# EAGLE design V5.9aSMD (EAGLE 7.6.0)
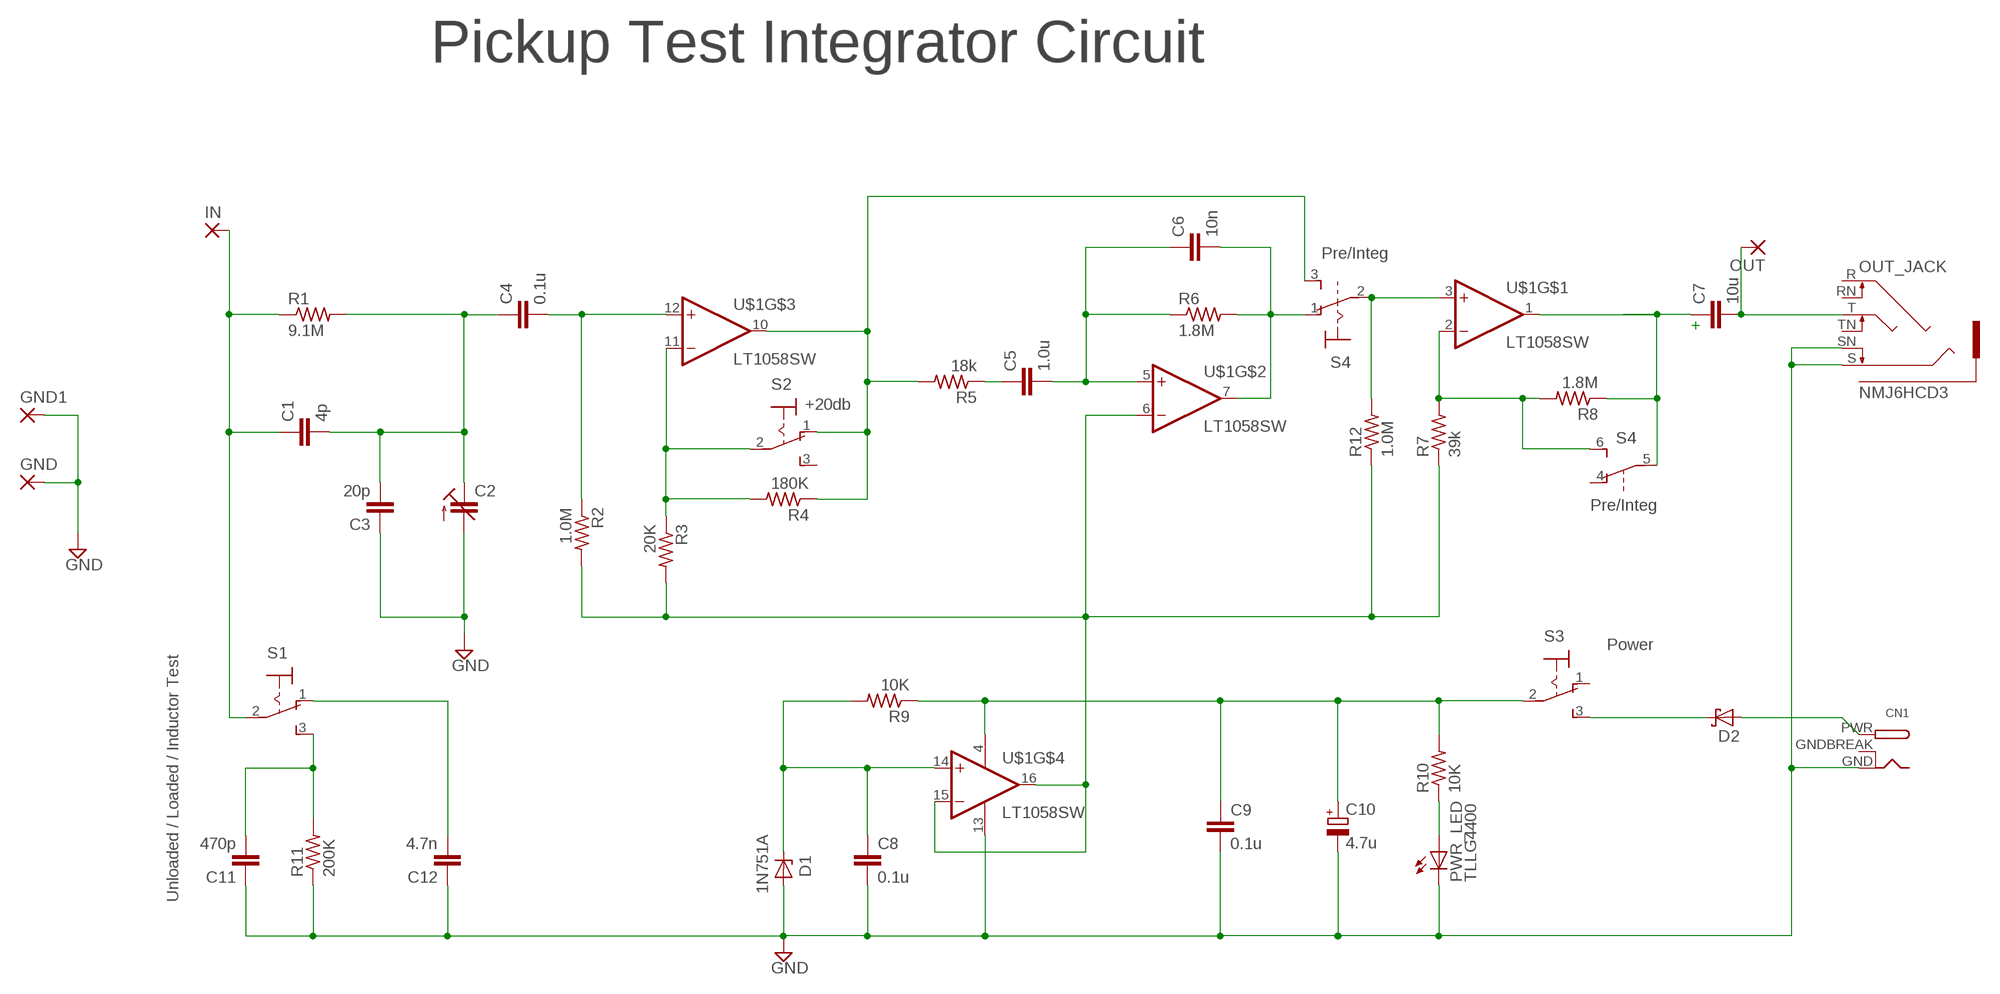
[diagram p0: schematic, sheet 1]

## Parts
C1  4p  C-EUC0805  [C0805]
C2  C-TRIMMGKG20015  [GKG20015]
C3  20p  C-EUC0805  [C0805]
C4  0.1u  C-EUC0805  [C0805]
C5  1.0u  C-EUC0805  [C0805]
C6  10n  C-EUC0805  [C0805]
C7  10u  C-EUC1206K  [C1206K]
C8  0.1u  C-EUC0805  [C0805]
C9  0.1u  C-EUC0805  [C0805]
C10  4.7u  CPOL-EUA/3216-18R  [A/3216-18R]
C11  470p  C-EUC0805  [C0805]
C12  4.7n  C-EUC0805  [C0805]
CN1  DCBARRELPTH  [DCJACK_2MM_PTH]
D1  ZENER-DIODESOD80C  [SOD80C]
D2  SCHOTTKY-DIODESMD  [SMB]
GND  2,54/1,1  [2,54/1,1]
GND1  2,54/1,1  [2,54/1,1]
IN  2,54/1,1  [2,54/1,1]
OUT  2,54/1,1  [2,54/1,1]
OUT_JACK  NMJ6HCD3  [AUDIO_JACK_NEUTRIK]
PWR_LED  TLLG4400  [LED3MM]
R1  9.1M  R-US_R0805  [R0805]
R2  1.0M  R-US_R0805  [R0805]
R3  20K  R-US_R0805  [R0805]
R4  180K  R-US_R0805  [R0805]
R5  18k  R-US_R0805  [R0805]
R6  1.8M  R-US_R0805  [R0805]
R7  39k  R-US_R0805  [R0805]
R8  1.8M  R-US_R0805  [R0805]
R9  10K  R-US_R0805  [R0805]
R10  10K  R-US_R0805  [R0805]
R11  200K  R-US_R0805  [R0805]
R12  1.0M  R-US_R0805  [R0805]
S1  320-916  [320-916]
S2  320-916  [320-916]
S3  320-916  [320-916]
S4  320-938  [320-938]
U$1  LT1058SW  [SO16W]

## Nets
GND: C2.1(A) C3.1 C8.2 C9.2 C10.- C11.1 C12.1 CN1.GND D1.A GND1.1(P) GND.1(P) OUT_JACK.S OUT_JACK.SN PWR_LED.K(C) R11.1 U$1.13(V-)
IT: C12.2 S1.1(O)
N$1: PWR_LED.A R10.1
N$2: C5.1 R5.1
N$3: D2.C S3.3(S)
N$4: R4.1 R5.2 S2.1(O) S4.3(1:S) U$1.10(OUT)
N$5: R3.1 R4.2 S2.2(P) U$1.11(-IN)
N$6: C6.2 R6.2 S4.1(1:O) U$1.7(OUT)
N$7: R7.2 R8.2 S4.6(B:S) U$1.2(-IN)
N$8: C7.1 R8.1 S4.5(B:P) U$1.1(OUT)
N$9: C1.2 C2.2(E) C3.2 C4.1 R1.2
N$10: C8.1 D1.C R9.2 U$1.14(+IN)
N$11: R12.2 S4.2(1:P) U$1.3(+IN)
N$12: C4.2 R2.1 U$1.12(+IN)
N$13: C1.1 IN.1(P) R1.1 S1.2(P)
N$14: R2.2 R3.2 R7.1 R12.1 U$1.6(-IN) U$1.15(-IN) U$1.16(OUT)
N$15: C9.1 C10.+ R9.1 R10.2 S3.2(P) U$1.4(V+)
N$16: C11.2 R11.2 S1.3(S)
N$18: C5.2 C6.1 R6.1 U$1.5(+IN)
N$21: CN1.PWR D2.A
N$22: C7.2 OUT.1(P) OUT_JACK.T
Unconnected: OUT_JACK.R OUT_JACK.RN OUT_JACK.TN S2.3(S) S3.1(O) S4.4(B:O)

## Notes on the sheet
- Pickup Test Integrator Circuit
- Pre/Integ
- +
- +20db
- Pre/Integ
- Power
- Unloaded / Loaded / Inductor Test

## Power pins joined to a net without a drawn wire
GNDBREAK: CN1.GNDBREAK

## Library data of the parts
C1 C3-C9 C11 C12 = rcl:C-EU: CAPACITOR, European symbol
C2 = rcl:C-TRIMM: Trimm capacitor
C10 = rcl:CPOL-EU: POLARIZED CAPACITOR, European symbol
CN1 = adafruit:DCBARREL: 2.0mm DC Barrel Jack DCJACK_2MM_PTH - Through Hole Jack (4UConnector: 05537)
D1 = diode:ZENER-DIODE: Z-Diode
D2 = diode:SCHOTTKY-DIODE: Schottky Diode
GND GND1 IN OUT = wirepad:2,54/1,1: THROUGH-HOLE PAD
OUT_JACK = Heliostat:NMJ6HCD3
PWR_LED = led:TLLG4400: Low Current (2mA) LED 3 mm Tinted Diffused Package color GREEN Source: Data sheet <http://www.farnell.com/datasheets/391098.pdf>; MF: VISHAY SEMICONDUCTOR; OC_FARNELL: 1612435
R1-R12 = rcl:R-US_: RESISTOR, American symbol
S1-S3 = switch:320-916: TOGGLE SWITCH distributor RS Components
S4 = switch:320-938: TOGGLE SWITCH distributor RS Components
U$1 = Heliostat:LT1058SW

## Board
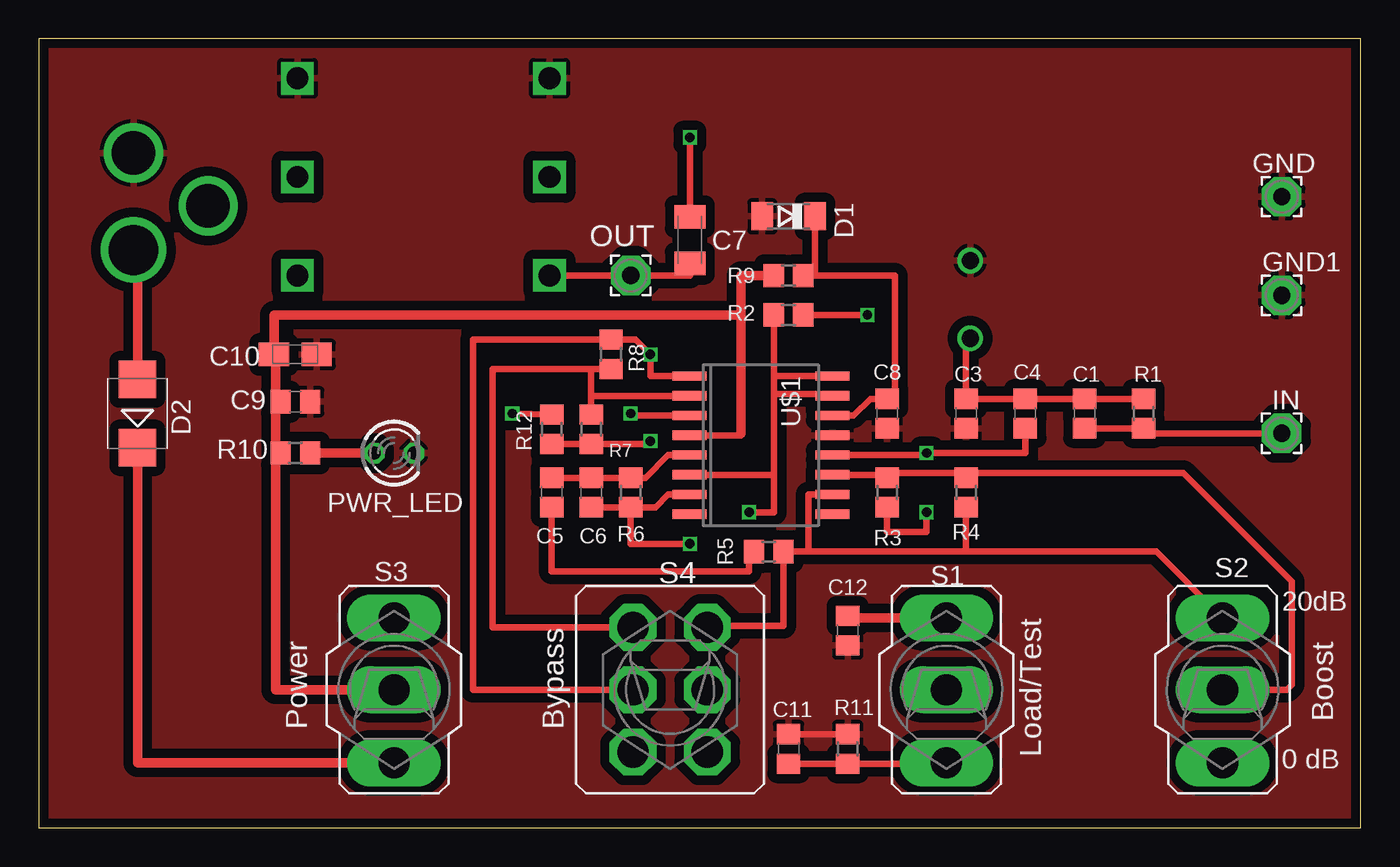
[diagram p1: board, top side]
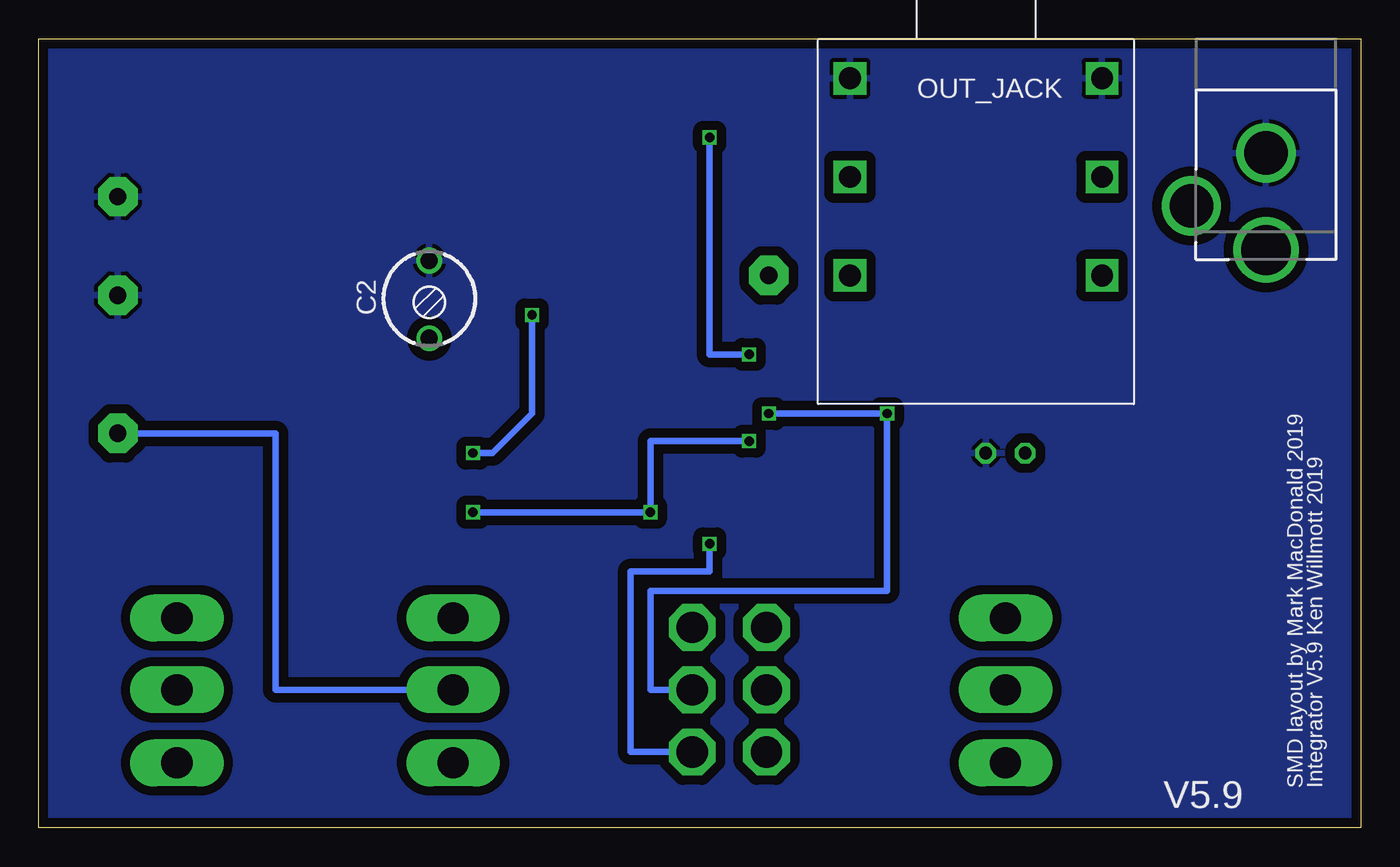
[diagram p2: board, bottom side, seen from below]

Size 85.09 x 50.8 mm. Coordinates in mm from the lower left corner, seen from the top.
Outline: 0,50.8 0,0 85.09,0 85.09,50.8 0,50.8
Copper layers (1*16): Top 0.035mm / dielectric 1.5mm / Bottom 0.035mm
Design rules "ITEADstudio_DRC": minimum track width 6mil, minimum drill 12mil, track to track 6mil, track to pad 6mil, pad to pad 6mil, via to via 6mil, smd to smd 0mil, copper to edge 10mil, drill to drill 10mil, minimum pad ring 10mil, minimum via ring 6mil, stop-mask expansion 2mil, vias tented up to drill 100mil, thermal gap 10mil

### Footprints (pad centres in the part's own frame; a part is rotated, then mirrored left to right if it is on the bottom)
C0805 = smd 1.3 x 1.5: 1 -0.95,0; 2 0.95,0
GKG20015 = drill 1.1: 1 -2.5,0; 2 2.5,0
C1206K = smd 1.5 x 2: 1 -1.5,0; 2 1.5,0
A/3216-18R = smd 1.95 x 1.5: + 1.375,0; - -1.375,0
DCJACK_2MM_PTH = drill 2.8: GND 0,7.35; GNDBREAK 4.8,10.75 | drill 3.2: PWR 0,13.6
SOD80C = smd 1.4 x 1.8: A 1.7,0; C -1.7,0
SMB = smd 2.4 x 2.4: A 2.2,0; C -2.2,0
2,54/1,1 = drill 1.118 pad 2.54 octagon: 1 0,0
AUDIO_JACK_NEUTRIK = drill 1.4 square: R -8.115,0; RN 8.115,0; S -8.115,6.35; SN 8.115,6.35; T -8.115,-6.35; TN 8.115,-6.35
LED3MM = drill 0.813 octagon: A -1.27,0; K 1.27,0
R0805 = smd 1.3 x 1.5: 1 -0.95,0; 2 0.95,0
320-916 = drill 2.007 long: 1 0,4.613; 2 0,0; 3 0,-4.713
320-938 = drill 2.007 octagon: 1 -2.388,4.013; 2 -2.388,0; 3 -2.388,-4.013; 4 2.388,4.013; 5 2.388,0; 6 2.388,-4.013
SO16W = smd 0.6 x 2.2: 1 -4.445,-4.6; 2 -3.175,-4.6; 3 -1.905,-4.6; 4 -0.635,-4.6; 5 0.635,-4.6; 6 1.905,-4.6; 7 3.175,-4.6; 8 4.445,-4.6; 9 4.445,4.6; 10 3.175,4.6; 11 1.905,4.6; 12 0.635,4.6; 13 -0.635,4.6; 14 -1.905,4.6; 15 -3.175,4.6; 16 -4.445,4.6

### Placement (x,y rotation side)
C1  67.31,26.67 90 top
C2  59.96,34.02 270 bottom
C3  59.69,26.67 90 top
C4  63.5,26.67 270 top
C5  33.02,21.59 90 top
C6  35.56,21.59 270 top
C7  41.91,37.85 270 top
C8  54.61,26.67 270 top
C9  16.51,27.43 0 top
C10  16.51,30.48 180 top
C11  48.26,5.08 270 top
C12  52.07,12.7 90 top
CN1  6.1,50.8 180 bottom
D1  48.26,39.37 180 top
D2  6.35,26.67 90 top
GND  80.01,40.64 0 top
GND1  80.01,34.29 0 top
IN  80.01,25.4 0 top
OUT  38.1,35.56 180 top
OUT_JACK  24.77,41.91 0 bottom
PWR_LED  22.86,24.13 0 top
R1  71.12,26.67 90 top
R2  48.26,33.02 180 top
R3  54.61,21.59 270 top
R4  59.69,21.59 90 top
R5  46.99,17.78 0 top
R6  38.1,21.59 270 top
R7  35.56,25.65 90 top
R8  36.83,30.48 270 top
R9  48.26,35.56 0 top
R10  16.51,24.13 180 top
R11  52.07,5.08 270 top
R12  33.02,25.65 90 top
S1  58.42,8.89 0 top
S2  76.2,8.89 0 top
S3  22.86,8.89 0 top
S4  40.64,8.89 180 top
U$1  46.48,24.64 270 top

### Tracks (layer width: path | path; a pad name or v marks a point on that pad's centre or on a via)
GND
  Top 0.406: C8.2 54.29,25.4 | R11.1 C11.1
  pour Bottom (isolate 0.61): 0,-1.27 0,53.34 86.36,53.34 86.36,-1.27
  pour Top (isolate 0.61): -3.81,-2.54 -3.81,53.34 88.9,53.34 88.9,-2.54
IT
  Top 0.61: S1.1 52.07,13.5 C12.2
N$1
  Top 0.61: R10.1 PWR_LED.A
N$2
  Top 0.406: C5.1 33.02,16.51 45.72,16.51 45.72,17.78 R5.1
N$3
  Top 0.61: D2.C 6.35,4.18 S3.3
N$4
  Top 0.406: 49.53,17.78 R5.2 47.94,12.99 43.03,12.99 S4.3 | 49.53,17.78 49.53,21.46 U$1.10 | 49.53,17.78 59.69,17.78 | R4.1 59.69,17.78 | 59.69,17.78 71.92,17.78 S2.1
N$5
  Top 0.406: 54.93,22.86 R3.1 | 59.69,22.86 73.66,22.86 80.64,15.88 80.64,9.21 80.33,8.89 S2.2 | 59.69,22.86 54.61,22.86 R3.1 | R4.2 59.69,22.86 | U$1.11 54.61,22.73 R3.1
N$6  (via drill 0.6)
  Top 0.406: R6.2 C6.2 | v41.91,18.29 38.1,18.29 R6.2 | U$1.7 40.51,21.46 39.69,20.64 R6.2
  Bottom 0.406: S4.1 46.99,4.88 46.99,16.51 41.91,16.51 v41.91,18.29
N$7
  Top 0.406: S4.6 29.21,12.9 29.21,29.53 35.56,29.53 | 35.56,29.53 R8.2 | U$1.2 35.56,27.81 | R7.2 35.56,27.81 | 35.56,29.53 35.56,27.94 35.56,27.81
N$8  (via drill 0.6)
  Top 0.406: S4.5 27.94,8.89 27.94,31.43 R8.1 38.42,31.43 v39.37,30.48 39.37,29.08 U$1.1 | C7.1 v41.91,44.45
  Bottom 0.406: v41.91,44.45 41.91,30.48 v39.37,30.48
N$9
  Top 0.406: R1.2 C1.2 C4.1 C3.2 59.69,31.52 C2.2
N$10
  Top 0.406: U$1.14 52.45,26.54 53.53,27.62 C8.1 54.29,27.94 55.12,27.94 55.12,35.56 R9.2 49.96,35.56 D1.C
N$11  (via drill 0.6)
  Top 0.406: v30.48,26.67 R12.2 | U$1.3 38.1,26.54 v38.1,26.67
  Bottom 0.406: v38.1,26.67 v30.48,26.67 30.48,15.24 45.72,15.24 45.72,8.89 S4.2
N$12  (via drill 0.6)
  Top 0.406: v53.34,33.02 R2.1 | C4.2 63.5,24.13 v57.15,24.13 57.15,24 U$1.12
  Bottom 0.406: v57.15,24.13 55.88,24.13 53.34,26.67 v53.34,33.02
N$13
  Top 0.406: C1.1 R1.1 71.12,25.4 IN.1
  Bottom 0.406: IN.1 69.85,25.4 69.85,8.89 S1.2
N$14  (via drill 0.6)
  Top 0.406: 47.31,29.08 R2.2 | R3.2 54.61,19.05 57.15,19.05 v57.15,20.32 | 47.31,29.08 U$1.16 | U$1.15 51.08,27.94 47.31,27.94 | 47.31,27.94 47.31,29.08 | 47.31,27.94 47.31,22.73 | 47.31,22.73 47.31,20.32 v45.72,20.32 | U$1.6 47.31,22.73 | R12.1 R7.1 39.37,24.7 v39.37,24.89
  Bottom 0.406: v57.15,20.32 v45.72,20.32 45.72,24.89 v39.37,24.89
N$15
  Top 0.406: 45.21,25.4 45.21,25.27 U$1.4
  Top 0.61: S3.2 15.24,8.89 15.24,24.13 | 15.24,24.13 15.24,26.67 | 15.24,26.67 15.24,30.48 C10.+ 15.13,33.02 45.21,33.02 | 45.21,25.4 45.21,33.02 | R9.1 45.21,35.56 45.21,33.02 | C9.1 15.24,26.67 | R10.2 15.24,24.13
N$16
  Top 0.406: S1.3 58.42,4.13 R11.2 C11.2
N$18
  Top 0.406: R6.1 C6.1 C5.2 | 38.1,22.86 R6.1 | U$1.5 40.51,24 39.05,22.54 R6.1
N$21
  Top 0.61: D2.A 6.35,35.93 CN1.PWR
N$22
  Top 0.406: C7.2 41.91,35.56 OUT.1 OUT_JACK.T

### Text on the board
tPlace: Boost | Power | Bypass | Load/Test
tNames: 20dB | 0 dB
bNames: Integrator V5.9 Ken Willmott 2019 | SMD layout by Mark MacDonald 2019 | V5.9